# EAGLE schematic LED (EAGLE 6.2)
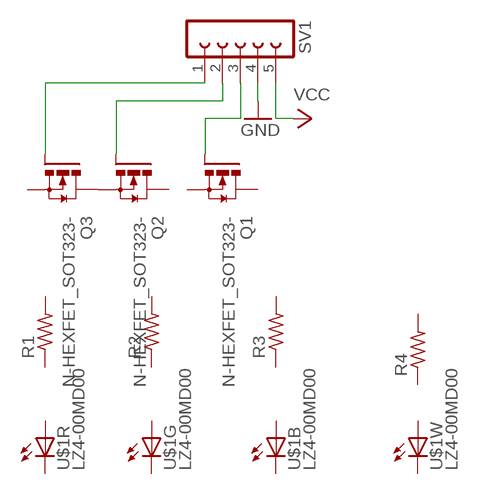
[diagram p0: schematic, sheet 1]

## Parts
Q1  N-HEXFET_SOT323-  [SOT223]
Q2  N-HEXFET_SOT323-  [SOT223]
Q3  N-HEXFET_SOT323-  [SOT223]
R1  R-US_0204/7  [0204/7]
R2  R-US_0204/7  [0204/7]
R3  R-US_0204/7  [0204/7]
R4  R-US_0204/7  [0204/7]
SV1  FE05-1  [FE05-1]
U$1  LZ4-00MD00  [LZ4-00MD0]

## Nets
GND: SV1.4
N$1: Q2.3(S) Q3.4(D)
N$2: Q3.1(G) SV1.1
N$3: Q2.1(G) SV1.2
N$4: Q1.1(G) SV1.3
VCC: SV1.5
Unconnected: Q1.3(S) Q1.4(D) Q2.4(D) Q3.3(S) R1.1 R1.2 R2.1 R2.2 R3.1 R3.2 R4.1 R4.2 U$1.1(W:A) U$1.2(W:C) U$1.3(R:A) U$1.4(R:C) U$1.5(G:A) U$1.6(G:C) U$1.7(B:A) U$1.8(B:C)

## Library data of the parts
Q1-Q3 = transistor-power:N-HEXFET_?-*: HEXFET® Power MOSFET
R1-R4 = rcl:R-US_: RESISTOR, American symbol
SV1 = con-lsta:FE05-1: FEMALE HEADER; OC_FARNELL: unknown; OC_NEWARK: unknown
U$1 = led:LZ4-00MD00